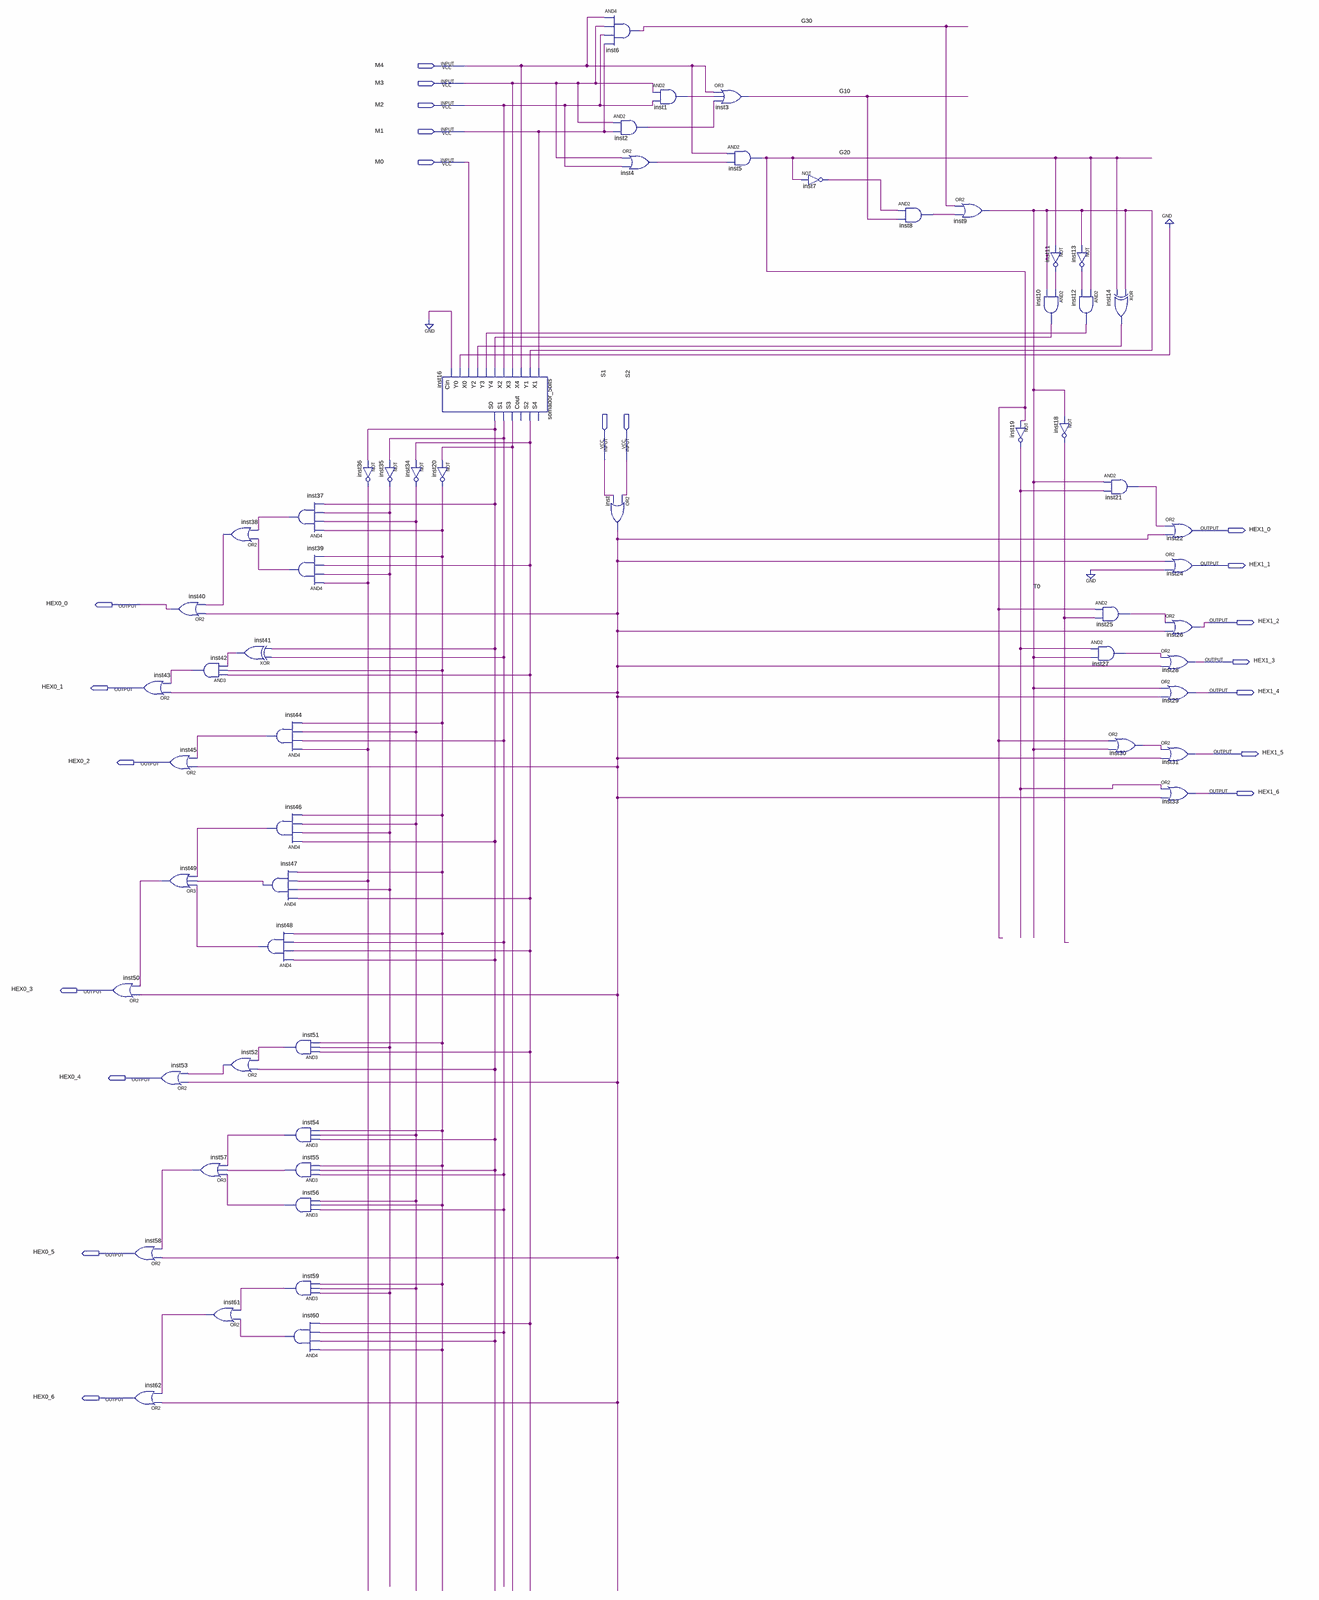
[diagram p0: schematic sheet, whole]
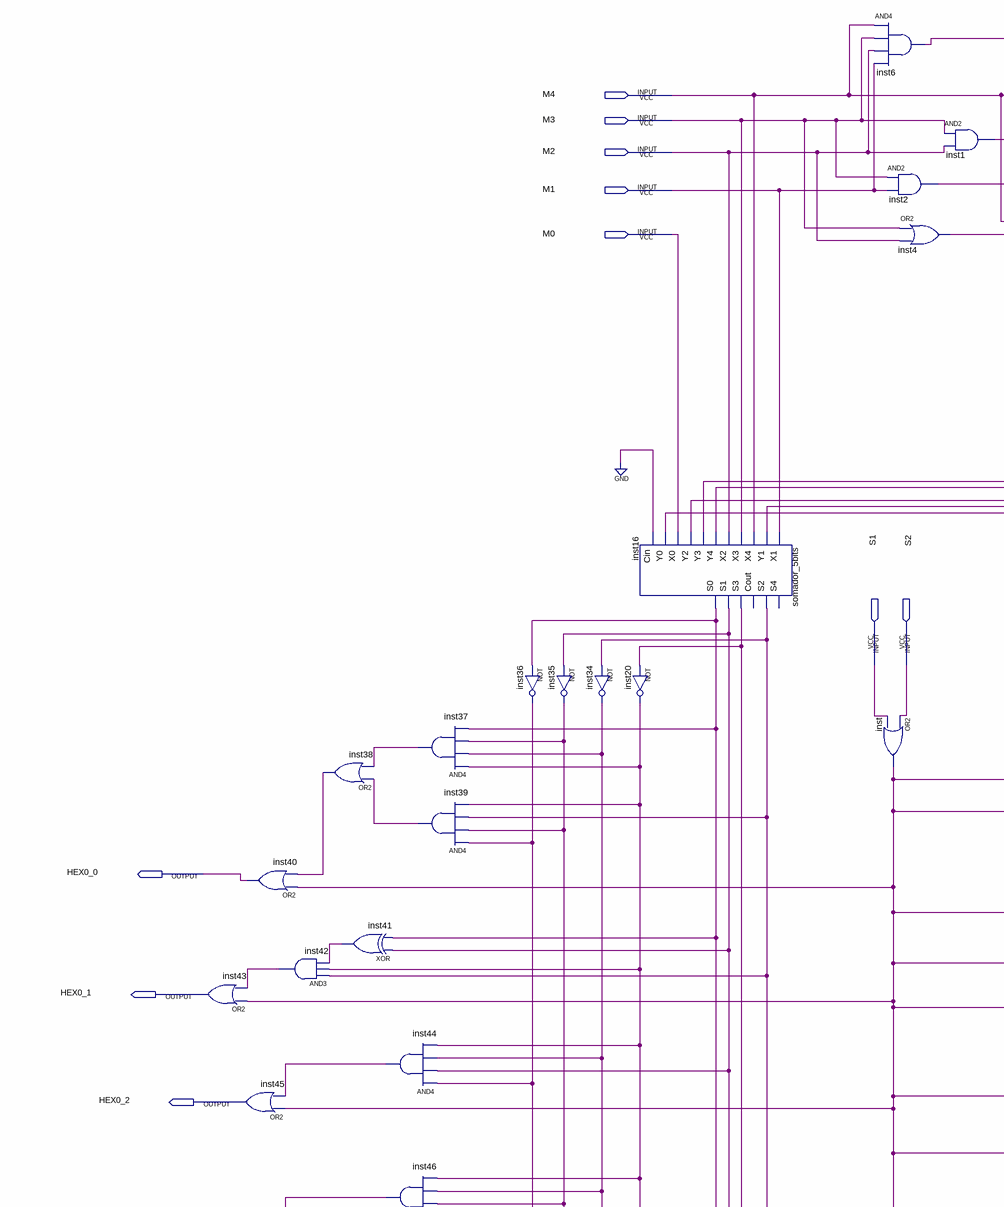
[diagram p1: schematic sheet, upper left part]
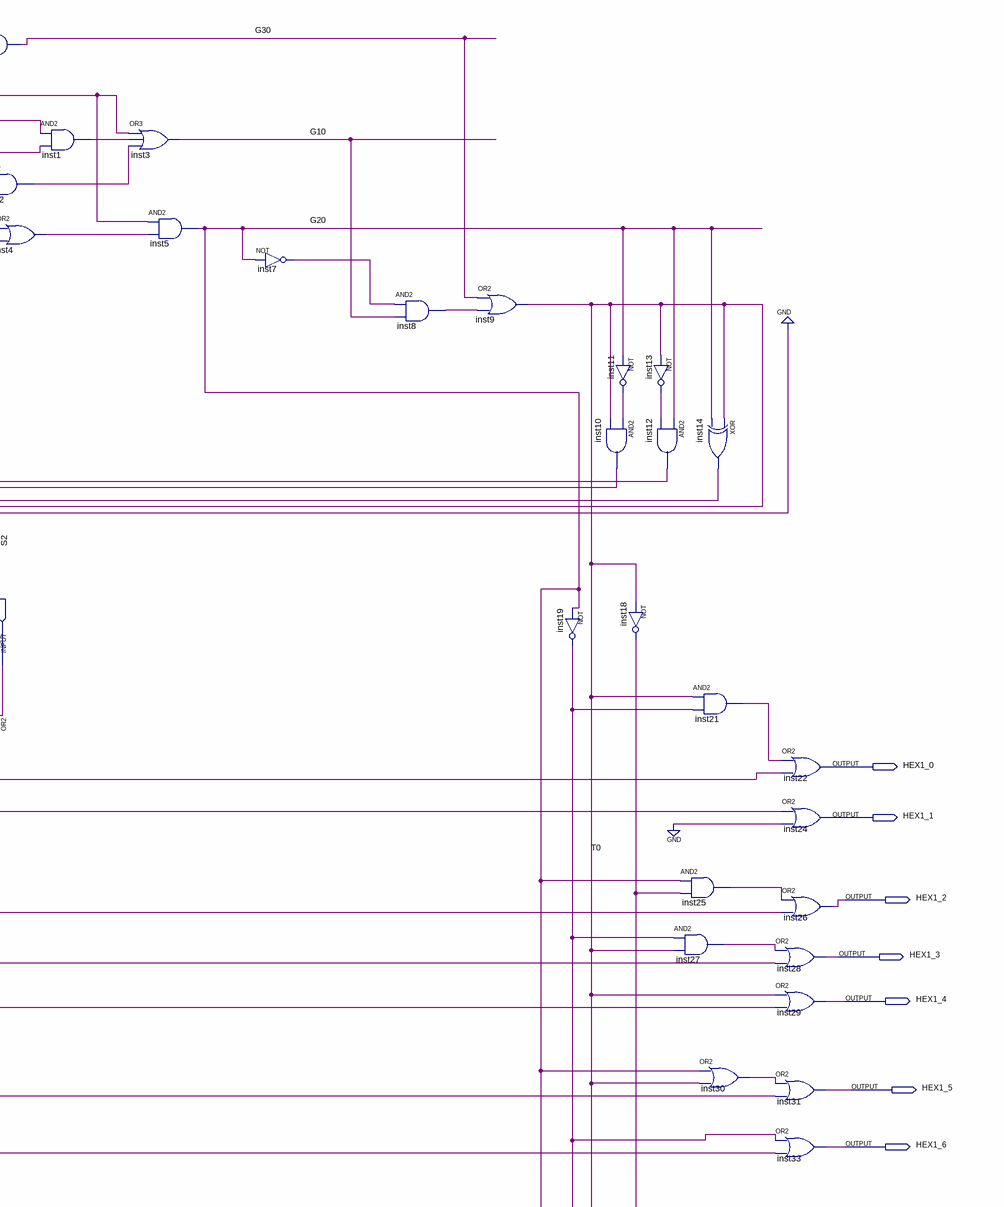
[diagram p2: schematic sheet, upper right part]
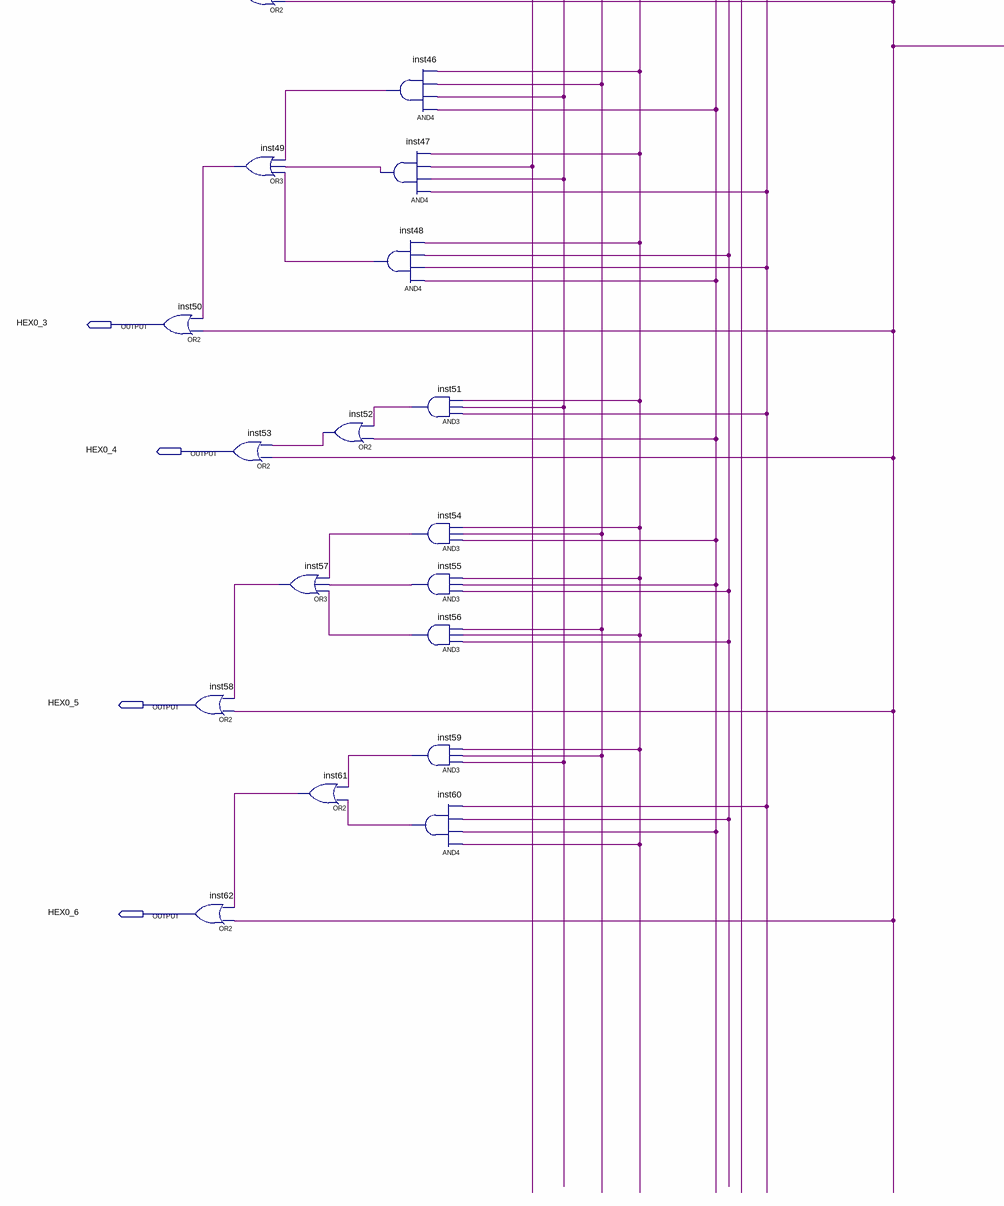
[diagram p3: schematic sheet, lower left part]
// Quartus schematic decodificador_final.bdf as structural Verilog: 59 symbols, 21 pins
module decodificador_final (
  input  M4,
  input  M3,
  input  M2,
  input  M1,
  input  M0,
  input  S1,
  input  S2,
  output HEX1_0,
  output HEX1_1,
  output HEX0_0,
  output HEX1_2,
  output HEX1_3,
  output HEX0_1,
  output HEX1_4,
  output HEX1_5,
  output HEX0_2,
  output HEX1_6,
  output HEX0_3,
  output HEX0_4,
  output HEX0_5,
  output HEX0_6
);

  wire G10, G20, G30, inst1_out, inst2_out, inst4_out, inst7_out, inst8_out, inst10_out, inst11_out,
       inst12_out, inst13_out, inst14_out, inst16_s0, inst16_s1, inst16_s2, inst16_s3, inst18_out,
       inst19_out, inst20_out, inst21_out, inst25_out, inst27_out, inst30_out, inst34_out, inst35_out,
       inst36_out, inst37_out, inst38_out, inst39_out, inst41_out, inst42_out, inst44_out, inst46_out,
       inst47_out, inst48_out, inst49_out, inst51_out, inst52_out, inst54_out, inst55_out, inst56_out,
       inst57_out, inst59_out, inst60_out, inst61_out, inst_out, T0;

  or inst50 (HEX0_3, inst_out, inst49_out);
  or inst43 (HEX0_1, inst_out, inst42_out);
  or inst58 (HEX0_5, inst_out, inst57_out);
  or inst62 (HEX0_6, inst_out, inst61_out);
  or inst40 (HEX0_0, inst_out, inst38_out);
  or inst45 (HEX0_2, inst_out, inst44_out);
  or inst49 (inst49_out, inst48_out, inst47_out, inst46_out);
  or inst53 (HEX0_4, inst_out, inst52_out);
  and inst42 (inst42_out, inst16_s2, inst20_out, inst41_out);
  or inst57 (inst57_out, inst56_out, inst55_out, inst54_out);
  or inst61 (inst61_out, inst60_out, inst59_out);
  or inst38 (inst38_out, inst39_out, inst37_out);
  xor inst41 (inst41_out, inst16_s1, inst16_s0);
  or inst52 (inst52_out, inst16_s0, inst51_out);
  and inst44 (inst44_out, inst36_out, inst16_s1, inst34_out, inst20_out);
  and inst46 (inst46_out, inst16_s0, inst35_out, inst34_out, inst20_out);
  and inst47 (inst47_out, inst16_s2, inst35_out, inst36_out, inst20_out);
  and inst48 (inst48_out, inst16_s0, inst16_s2, inst16_s1, inst20_out);
  and inst37 (inst37_out, inst20_out, inst34_out, inst35_out, inst16_s0);
  and inst39 (inst39_out, inst36_out, inst35_out, inst16_s2, inst20_out);
  and inst51 (inst51_out, inst16_s2, inst35_out, inst20_out);
  and inst54 (inst54_out, inst16_s0, inst34_out, inst20_out);
  and inst55 (inst55_out, inst16_s1, inst16_s0, inst20_out);
  and inst56 (inst56_out, inst16_s1, inst20_out, inst34_out);
  and inst59 (inst59_out, inst35_out, inst34_out, inst20_out);
  and inst60 (inst60_out, inst20_out, inst16_s0, inst16_s1, inst16_s2);
  not inst35 (inst35_out, inst16_s1);
  not inst36 (inst36_out, inst16_s0);
  not inst34 (inst34_out, inst16_s2);
  somador_5bits inst16 (
    .X1(M1), .Y1(T0), .X4(M4), .X3(M3), .X2(M2), .Y4(inst10_out), .Y3(inst12_out), .Y2(inst14_out), .X0(M0),
    .Y0(1'b0), .Cin(1'b0), .S2(inst16_s2), .S3(inst16_s3), .S1(inst16_s1), .S0(inst16_s0));  // open: S4, Cout
  not inst20 (inst20_out, inst16_s3);
  and inst6 (G30, M4, M3, M2, M1);
  and inst2 (inst2_out, M3, M1);
  or inst4 (inst4_out, M3, M2);
  or inst (inst_out, S2, S1);
  and inst1 (inst1_out, M3, M2);
  or inst3 (G10, M4, inst1_out, inst2_out);
  and inst5 (G20, M4, inst4_out);
  not inst7 (inst7_out, G20);
  and inst8 (inst8_out, inst7_out, G10);
  or inst9 (T0, G30, inst8_out);
  not inst19 (inst19_out, G20);
  not inst11 (inst11_out, G20);
  and inst10 (inst10_out, inst11_out, T0);
  not inst13 (inst13_out, T0);
  and inst12 (inst12_out, G20, inst13_out);
  not inst18 (inst18_out, T0);
  xor inst14 (inst14_out, T0, G20);
  and inst21 (inst21_out, T0, inst19_out);
  and inst25 (inst25_out, G20, inst18_out);
  and inst27 (inst27_out, inst19_out, T0);
  or inst30 (inst30_out, G20, T0);
  or inst22 (HEX1_0, inst21_out, inst_out);
  or inst24 (HEX1_1, inst_out, 1'b0);
  or inst26 (HEX1_2, inst25_out, inst_out);
  or inst28 (HEX1_3, inst27_out, inst_out);
  or inst29 (HEX1_4, T0, inst_out);
  or inst31 (HEX1_5, inst30_out, inst_out);
  or inst33 (HEX1_6, inst19_out, inst_out);
endmodule
